# Altium project Payload Development Kit.PrjPcb
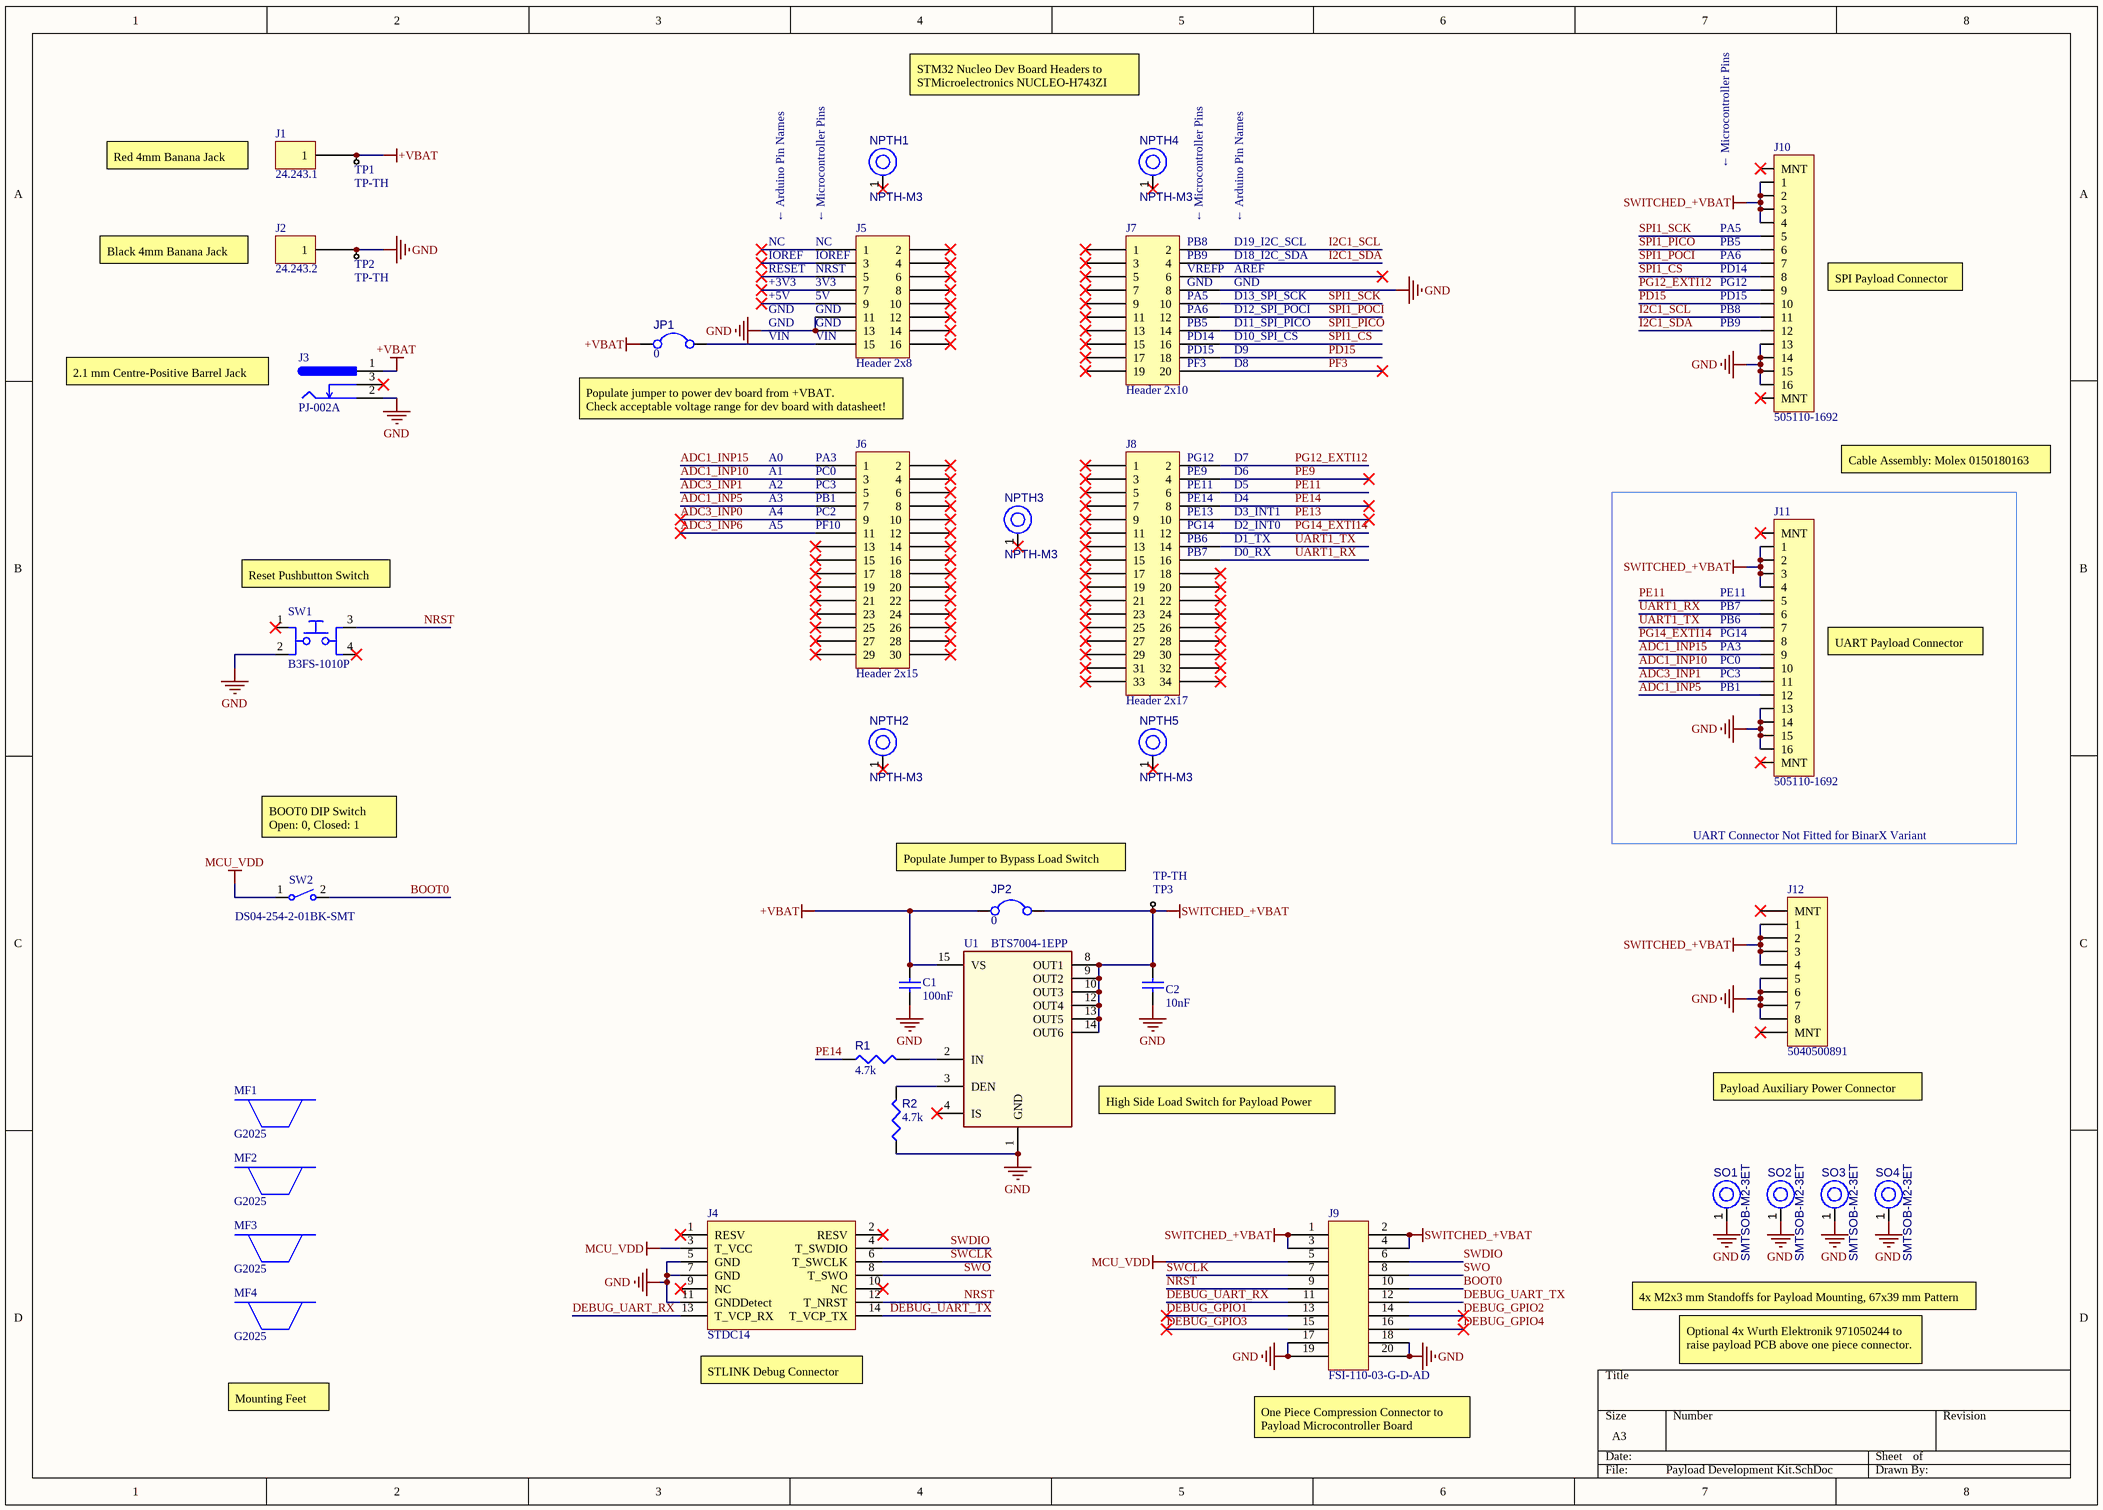
[diagram p0: Payload Development Kit.SchDoc]
1 sheet, 37 parts. Net scope: global (net labels, ports and power ports of the same name join across sheets).
Board file: Payload Development Kit.PcbDoc

## Sheet Payload Development Kit.SchDoc
size A3; Author: R Howie; CompanyName: Space Science and Technology Centre at Curtin University; SheetNumber: 1; SheetTotal: 1; Time: Binar Payload Development Kit

### Parts
C1  value 100nF  [CAPC1608X90X40ML10T20]  (hidden comment: Capacitor 100 nF +/-10% 50 V 0603)
C2  value 10nF  [CAPC1608X90X40NL10T20]  (hidden comment: Capacitor 10 nF +/-10% 50 V 0603)
J1  24.243.1  [FP-24_243_1-MFG]
J2  24.243.2  [FP-24_243_2-MFG]
J3  PJ-002A  [CUI-PJ-002A_V]
J4  STDC14  [FP-FTSH-107-01-L-DV-K]
J5  Header 2x8  [SAMTEC_SSW-108-01-T-D]
J6  Header 2x15  [SAMTEC_SSW-115-01-T-D]
J7  Header 2x10  [SAMTEC_SSW-110-01-T-D]
J8  Header 2x17  [SAMTEC_SSW-117-01-T-D]
J9  FSI-110-03-G-D-AD  [SAMTEC_FSI-110-03-X-D-AD-TR]
J10  505110-1692  [FP-505110-1692-MFG]
J11  505110-1692  [FP-505110-1692-MFG]
J12  5040500891  [CON_5040500891]
JP1  value 0  [RESC1608X55X25ML10T15]  (hidden comment: CMP-009-00177-3)
JP2  value 0  [RESC1608X55X25ML10T15]  (hidden comment: 26A 0603 Jumper)
MF1  G2025  [New footprint 1]
MF2  G2025  [New footprint 1]
MF3  G2025  [New footprint 1]
MF4  G2025  [New footprint 1]
NPTH1  NPTH-M3  [NPTH-M3]  (no BOM)
NPTH2  NPTH-M3  [NPTH-M3]  (no BOM)
NPTH3  NPTH-M3  [NPTH-M3]  (no BOM)
NPTH4  NPTH-M3  [NPTH-M3]  (no BOM)
NPTH5  NPTH-M3  [NPTH-M3]  (no BOM)
R1  value 4.7k  [RESC1608X55X25ML10T15]  (hidden comment: Resistor 4k7 +/-1% 0603 100 mW)
R2  value 4.7k  [RESC1608X55X25ML10T15]  (hidden comment: Resistor 4k7 +/-1% 0603 100 mW)
SO1  SMTSOB-M2-3ET  [SMTSOB-M2-3ET]
SO2  SMTSOB-M2-3ET  [SMTSOB-M2-3ET]
SO3  SMTSOB-M2-3ET  [SMTSOB-M2-3ET]
SO4  SMTSOB-M2-3ET  [SMTSOB-M2-3ET]
SW1  B3FS-1010P  [B3FS-1010P-Footprint-1]
SW2  DS04-254-2-01BK-SMT  [SW_DS04-254-1-01BK-SMT]
TP1  TP-TH  [1 Pin Header Strip Footprint]
TP2  TP-TH  [1 Pin Header Strip Footprint]
TP3  TP-TH  [1 Pin Header Strip Footprint]
U1  BTS7004-1EPP  [SOP65P600X105-15N-1-V]

### Nets
+VBAT: C1.1 J1.1 J1.2 J3.1 JP1.1 JP2.1 TP1.1(TP) U1.15(VS)
GND: C1.2 C2.1 J2.1 J2.2 J3.2 J4.5(GND) J4.7(GND) J4.11(GNDDetect) J5.11 J5.13 J7.8 J9.17 J9.18 J9.19 J9.20 J10.13 J10.14 J10.15 J10.16 J11.13 J11.14 J11.15 J11.16 J12.5 J12.6 J12.7 J12.8 R2.1 SO1.1(H1) SO2.1(H1) SO3.1(H1) SO4.1(H1) SW1.2 TP2.1(TP) U1.1(GND)
MCU_VDD: J4.3(T_VCC) J9.5 SW2.1
SWITCHED_+VBAT: C2.2 J9.1 J9.2 J9.3 J9.4 J10.1 J10.2 J10.3 J10.4 J11.1 J11.2 J11.3 J11.4 J12.1 J12.2 J12.3 J12.4 JP2.2 TP3.1(TP) U1.8(OUT1) U1.9(OUT2) U1.10(OUT3) U1.12(OUT4) U1.13(OUT5) U1.14(OUT6)
ADC1_INP5: J6.7 J11.12
ADC1_INP10: J6.3 J11.10
ADC1_INP15: J6.1 J11.9
ADC3_INP0: J6.9
ADC3_INP1: J6.5 J11.11
ADC3_INP6: J6.11
BOOT0: J9.10 SW2.2
DEBUG_GPIO1: J9.13
DEBUG_GPIO2: J9.14
DEBUG_GPIO3: J9.15
DEBUG_GPIO4: J9.16
DEBUG_UART_RX: J4.13(T_VCP_RX) J9.11
DEBUG_UART_TX: J4.14(T_VCP_TX) J9.12
I2C1_SCL: J7.2 J10.11
I2C1_SDA: J7.4 J10.12
NRST: J4.12(T_NRST) J9.9 SW1.3
PD15: J7.18 J10.10
PE9: J8.4
PE11: J8.6 J11.5
PE13: J8.10
PE14: J8.8 R1.1
PF3: J7.20
PG12_EXTI12: J8.2 J10.9
PG14_EXTI14: J8.12 J11.8
SPI1_CS: J7.16 J10.8
SPI1_PICO: J7.14 J10.6
SPI1_POCI: J7.12 J10.7
SPI1_SCK: J7.10 J10.5
SWCLK: J4.6(T_SWCLK) J9.7
SWDIO: J4.4(T_SWDIO) J9.6
SWO: J4.8(T_SWO) J9.8
UART1_RX: J8.16 J11.6
UART1_TX: J8.14 J11.7
NetJ5_15: J5.15 JP1.2
NetR1_2: R1.2 U1.2(IN)
NetR2_2: R2.2 U1.3(DEN)

Not connected (* = marked no-connect by the designer): J3 3*; J4 1(RESV)* 2(RESV)* 9(NC)* 10(NC)*; J5 1* 2* 3* 4* 5* 6* 7* 8* 9* 10* 12* 14* 16*; J6 2* 4* 6* 8* 10* 12* 13* 14* 15* 16* 17* 18* 19* 20* 21* 22* 23* 24* 25* 26* 27* 28* 29* 30*; J7 1* 3* 5* 6* 7* 9* 11* 13* 15* 17* 19*; J8 1* 3* 5* 7* 9* 11* 13* 15* 17* 18* 19* 20* 21* 22* 23* 24* 25* 26* 27* 28* 29* 30* 31* 32* 33* 34*; J10 17(MNT)* 18(MNT)*; J11 17(MNT)* 18(MNT)*; J12 9(MNT)* 10(MNT)*; NPTH1 1(H1)*; NPTH2 1(H1)*; NPTH3 1(H1)*; NPTH4 1(H1)*; NPTH5 1(H1)*; SW1 1* 4*; U1 4(IS)* 5(NC1) 6(NC2) 7(NC3) 11(NC4)

### Notes on the sheet
- STM32 Nucleo Dev Board Headers to
  STMicroelectronics NUCLEO-H743ZI
- Red 4mm Banana Jack
- (near J10) ← Microcontroller Pins
- NC
- ← Arduino Pin Names
- (near J5) NC
- ← Microcontroller Pins
- (near J7) PB8
- D19_I2C_SCL
- (near J10) PA5
- (near J10) PB5
- Black 4mm Banana Jack
- GND
- +5V
- +3V3
- RESET
- IOREF
- (near J5) IOREF
- (near J5) NRST
- (near J5) 3V3
- (near J5) 5V
- (near J5) GND
- (near J7) PB9
- (near J7) VREFP
- (near J7) GND
- (near J7) PA5
- (near J7) PA6
- D12_SPI_POCI
- D13_SPI_SCK
- AREF
- D18_I2C_SDA
- (near J10) PA6
- (near J10) PD14
- (near J10) PG12
- (near J10) PD15
- (near J10) PB8
- SPI Payload Connector
- 2.1 mm Centre-Positive Barrel Jack
- VIN
- (near J5) VIN
- (near J7) PB5
- (near J7) PD14
- (near J7) PD15
- (near J7) PF3
- D8
- D9
- D10_SPI_CS
- D11_SPI_PICO
- (near J10) PB9
- Populate jumper to power dev board from +VBAT.
  Check acceptable voltage range for dev board with datasheet!
- A0
- A1
- A2
- A3
- A4
- (near J6) PA3
- (near J6) PC0
- (near J6) PC3
- (near J6) PB1
- (near J6) PC2
- (near J8) PG12
- (near J8) PE9
- (near J8) PE11
- (near J8) PE14
- (near J8) PE13
- D3_INT1
- D4
- D5
- D6
- D7
- Cable Assembly: Molex 0150180163
- (near SW1) Reset Pushbutton Switch
- A5
- (near J6) PF10
- (near J8) PG14
- (near J8) PB6
- (near J8) PB7
- D0_RX
- D1_TX
- D2_INT0
- (near J11) PE11
- (near J11) PB6
- (near J11) PB7
- (near J11) PG14
- (near J11) PA3
- UART Payload Connector
- (near J11) PC0
- (near J11) PC3
- (near J11) PB1
- BOOT0 DIP Switch
  Open: 0, Closed: 1
- UART Connector Not Fitted for BinarX Variant
- Populate Jumper to Bypass Load Switch
- (near U1) High Side Load Switch for Payload Power
- (near J12) Payload Auxiliary Power Connector
- 4x M2x3 mm Standoffs for Payload Mounting, 67x39 mm Pattern
- (near J4) STLINK Debug Connector
- Optional 4x Wurth Elektronik 971050244 to raise payload PCB above one piece connector.
- Mounting Feet
- (near J9) One Piece Compression Connector to Payload Microcontroller Board

### Library data of the parts
C1 = CMP-001-00130-4: Chip Capacitor, 100 nF, +/- 10%, 50 V, 0603 (1608 Metric); Capacitor Type: Ceramic; Voltage Rating: 50V; Component Type: Standard; Case/Package: 0603; Mounting Technology: Surface Mount; Pins: 2; RoHS Compliant: Yes; Source: Components - 14.07.23 - 14.28.SchLib; Tolerance: 10%; Max Operating Temperature: 125°C; Design Item ID: CMP-001-00017-10; Min Operating Temperature: -55°C
C2 = CMP-001-00131-5: Chip Capacitor, 10 nF, +/- 10%, 50 V, 0603 (1608 Metric); Voltage Rating: 50V; Capacitor Type: Ceramic; Mounting Technology: SM; Pins: 2; Source: Components - 09.08.23 - 17.40.SchLib; Tolerance: 10%; Created By: Robert Howie; Case/Package: 0603; RoHS Compliant: Yes; Max Operating Temperature: 125°C; Min Operating Temperature: -55°C
J1 = CMP-002-00135-3: Banana Test Connector, 4mm, Socket, PCB Mount, 24 A, 60 VDC, Silver Plated Contacts, Red; Component Type: Connectors; Source: Spacecraft Emulator Nucleo-144 Shield.SCHLIB; Pins: 2; RoHS Compliant: Yes; Design Item ID: CMP-002-00024-4
J2 = CMP-002-00134-3: Banana Test Connector, 4mm, Socket, PCB Mount, 24 A, 60 VDC, Silver Plated Contacts, Black; Source: Spacecraft Emulator Nucleo-144 Shield.SCHLIB; Component Type: Connectors; Design Item ID: CMP-002-00023-3; Pins: 2; RoHS Compliant: Yes
J3 = CMP-002-00139-1: 2.1mm Dia Centre Pin, 5.5mm barrel, 24V, 2.5A; Connector Type: Circular,Power; Voltage Rating: 24V; Max Current Rating: 2.5A; RoHS Compliant: Yes; Mounting Technology: Board
J4 = CMP-049-000000-6: STDC14 for STLINK Programmer; Source: STDC14.SchLib; Design Item ID: CMP-002-00076-5; ComponentLink1URL: https://www.st.com/en/development-tools/stlink-v3mini.html#overview; RoHS Compliant: Yes; ComponentLink1Description: Manufacturer Link; Mounting Technology: Board
J5 = CMP-002-00130-14: Connector Type: BOARD CONNECTOR; Pins: 16; Max Operating Temperature: 125°C; RoHS Compliant: Yes; Mounting Technology: Board; Min Operating Temperature: -65°C; Source: Spacecraft Emulator Nucleo-144 Shield.SCHLIB; Design Item ID: CMP-002-00019-12; Component Type: Connectors
J6 = CMP-002-00131-10: Mounting Technology: Board; Max Operating Temperature: 125°C; Min Operating Temperature: -65°C; RoHS Compliant: Yes; Pins: 30; Design Item ID: CMP-002-00020-6; Component Type: Connectors; Source: Spacecraft Emulator Nucleo-144 Shield.SCHLIB
J7 = CMP-002-00132-12: Connector Type: BOARD CONNECTOR; RoHS Compliant: Yes; Pins: 20; Component Type: Connectors; Source: Spacecraft Emulator Nucleo-144 Shield.SCHLIB; Design Item ID: CMP-002-00021-9; Min Operating Temperature: -65°C; Mounting Technology: Board; Max Operating Temperature: 125°C
J8 = CMP-002-00133-10: Pins: 34; Mounting Technology: Board; RoHS Compliant: Yes; Min Operating Temperature: -65°C; Max Operating Temperature: 125°C; Source: Spacecraft Emulator Nucleo-144 Shield.SCHLIB; Component Type: Connectors; Design Item ID: CMP-002-00022-6
J9 = CMP-002-00138-2: 20 Position, 2 Row, 1mm Pich One Piece Connector, SMD, Samtec FSI-110-03-G-D-AD; Source: FSI-110-03-G-D-AD.SchLib; Design Item ID: CMP-002-00071-3; ComponentLink1Description: Manufacturer Page; ComponentLink1URL: https://www.samtec.com/products/fsi-110-03-g-d-ad
J10 J11 = CMP-002-00136-2: Conn FFC/FPC Connector SKT 16 POS 0.5mm Solder RA SMD Easy-On™ T/R; Design Item ID: CMP-002-00072-15; Pins: 18; Source: Spacecraft Emulator Nucleo-144 Shield.SCHLIB; Component Type: Connectors
J12 = CMP-002-00143-11: 1.50mm Pitch, Pico-Lock PCB Header, Single Row, Right-Angle, Surface Mount, Gold (Au) Plating, Positive Lock, 8 Circuits, Tape and Reel; Design Item ID: CMP-002-00075-1; Source: Components - 08.08.23 - 09.56.SchLib; ComponentLink1URL: https://www.molex.com/molex/products/part-detail/pcb_headers/5040500891; ComponentLink1Description: Manufacturer Page
JP1 = CMP-082-000000-1: Jumper 0603; Max Operating Temperature: 155°C; Source: Components - 20.07.23 - 16.55.SchLib; Pins: 2; Min Operating Temperature: -55°C; Pin Count: 2; Case/Package: 0603; Component Type: Standard; Design Item ID: CMP-009-00177-3
JP2 = CMP-009-00261-2: 28A Jumper 0603; Min Operating Temperature: -55°C; Max Operating Temperature: 155°C; Pin Count: 2; Case/Package: 0603; Design Item ID: CMP-009-00177-3; Component Type: Standard; Pins: 2; RoHS Compliant: Yes
MF1-MF4 = CMP-00028-00024-4: Rubber Push-In Bumper Ø12.7 mm by 12.7 mm high
NPTH1-NPTH5 = CMP-00000-2: M3 Non-Plated Through Hole; Pins: 1; Pin Count: 1; Component Type: Mechanical; Design Item ID: CMP-00028-00015-4; Source: Spacecraft Emulator Nucleo-144 Shield.SCHLIB
R1 R2 = CMP-009-00031-8: Chip Resistor, 4.7 KOhm, +/- 1%, 0.1 W, -55 to 155 degC, 0603 (1608 Metric); Power: 100mW; Min Operating Temperature: -55°C; Pins: 2; Mounting Technology: SM; Case/Package: 0603; Created By: Robert Howie; RoHS Compliant: True; Max Operating Temperature: 155°C; Tolerance: 1%
SO1-SO4 = CMP-00028-00023-1: M2x3mm SMD Standoff, Brass; Source: Components - 17.07.23 - 17.23.SchLib; Design Item ID: CMP-00028-00008-1; Pins: 1
SW1 = CMP-011-00019-2: Keypad Switch, 1 Switches, SPST, Momentary-tactile, 0.05A, 24VDC, 1.27N, Solder Terminal, Surface Mount-straight; Voltage Rating: 24V; Max Current Rating: 50mA; RoHS Compliant: Yes; Mounting Technology: Surface Mount; Min Operating Temperature: -25°C; Max Operating Temperature: 70°C
SW2 = CMP-011-00020-4: DIP Switch
TP1-TP3 = CMP-097-000000-3: Throughole Test Point; Design Item ID: CMP-001-0001-5; Created By: Robert Howie; Source: Components - 10.08.23 - 09.25.SchLib
U1 = CMP-011-00021-7: Smart High-Side Power Switch, 1x4 mΩ; Manufacturer: Infineon Technologies; Case/Package: PG-TSDSO-14-22; ManufacturerPartNumber: BTS7004-1EPP; Design Item ID: BTS7004-1EPP; Source: BTS7004-1EPP.SchLib

## Assembly variants
BinarX: not fitted J11 J12 JP1 JP2
AERO3001 Spacecraft Project: not fitted C2 C3 JP1 R1 R2 U1